# EAGLE design npk_schematic (EAGLE 9.6.2)
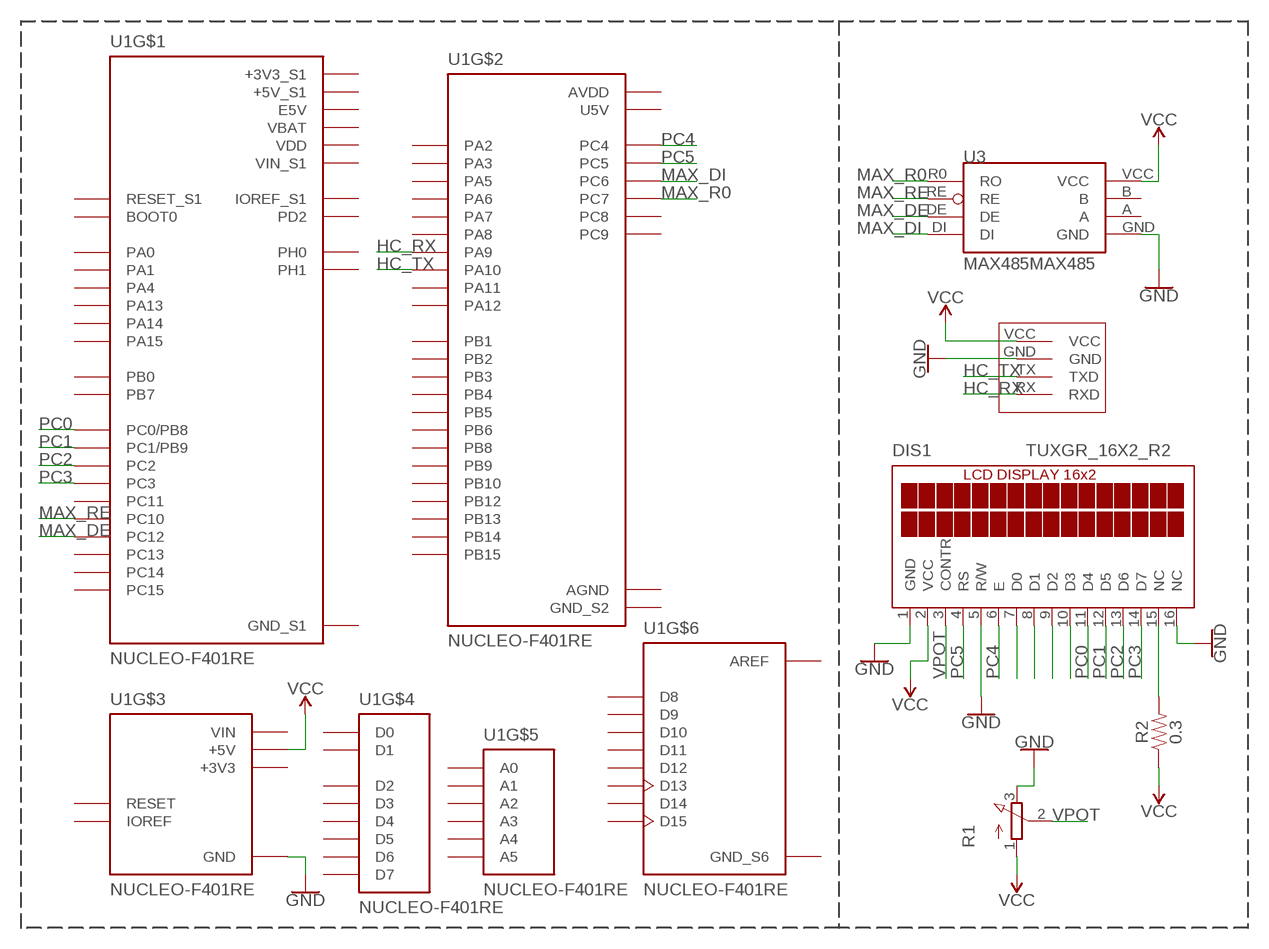
[diagram p0: schematic, sheet 1]

## Parts
DIS1  TUXGR_16X2_R2  [TUXGR_16X2_R2]
R1  3RP/1610N  [3RP/1610N]
R2  0.3  0.3OHM-0805-1/8W-1%  [0805]
U1  NUCLEO-F401RE  [ST_NUCLEO-F401RE]
U2  HC-06_ARDUıNO_BLUETOOTH  [HC-06_ARDUINO_BLUETOOTH]
U3  MAX485MAX485  [DIL08]

## Nets
GND: DIS1.1(GND) DIS1.5(R/W) DIS1.16(NC) R1.3(E) U1.GND@4(GND) U1.GND@6(GND) U2.GND U3.GND
HC_RX: U1.PA9@1(PA9) U2.RX(RXD)
HC_TX: U1.PA10@1(PA10) U2.TX(TXD)
MAX_DE: U1.PC12 U3.DE
MAX_DI: U1.PC6 U3.DI
MAX_R0: U1.PC7@1(PC7) U3.R0(RO)
MAX_RE: U1.PC10 U3.RE
N$1: DIS1.15(NC) R2.2
N$5: DIS1.7(D0)
N$6: DIS1.8(D1)
N$7: DIS1.9(D2)
N$8: DIS1.10(D3)
PC0: DIS1.11(D4) U1.PC0@1(PC0/PB8)
PC1: DIS1.12(D5) U1.PC1@1(PC1/PB9)
PC2: DIS1.13(D6) U1.PC2
PC3: DIS1.14(D7) U1.PC3
PC4: DIS1.6(E) U1.PC4
PC5: DIS1.4(RS) U1.PC5
VCC: DIS1.2(VCC) R1.1(A) R2.1 U1.+5V@2(+5V) U2.VCC U3.VCC
VPOT: DIS1.3(CONTR) R1.2(S)
Unconnected: U1.BOOTO(BOOT0) U1.IOREF@1(IOREF_S1) U1.IOREF@2(IOREF) U1.PA0@1(PA0) U1.PA0@2(A0) U1.PA1@1(PA1) U1.PA1@2(A1) U1.PA2@1(PA2) U1.PA2@2(D1) U1.PA3@1(PA3) U1.PA3@2(D0) U1.PA4@1(PA4) U1.PA4@2(A2) U1.PA5@1(PA5) U1.PA5@2(D13) U1.PA6@1(PA6) U1.PA6@2(D12) U1.PA7@1(PA7) U1.PA7@2(D11) U1.PA8@1(PA8) U1.PA8@2(D7) U1.PA9@2(D8) U1.PA10@2(D2) U1.PA11 U1.PA12 U1.PA13 U1.PA14 U1.PA15 U1.PB0@1(PB0) U1.PB0@2(A3) U1.PB1 U1.PB2 U1.PB3@1(PB3) U1.PB3@2(D3) U1.PB4@1(PB4) U1.PB4@2(D5) U1.PB5@1(PB5) U1.PB5@2(D4) U1.PB6@1(PB6) U1.PB6@2(D10) U1.PB7 U1.PB8@1(PB8) U1.PB8@2(D15) U1.PB9@1(PB9) U1.PB9@2(D14) U1.PB10@1(PB10) U1.PB10@2(D6) U1.PB12 U1.PB13 U1.PB14 U1.PB15 U1.PC0@2(A5) U1.PC1@2(A4) U1.PC7@2(D9) U1.PC8 U1.PC9 U1.PC11 U1.PC13 U1.PC14 U1.PC15 U1.PD2 U1.PH0 U1.PH1 U1.RESET@1(RESET_S1) U1.RESET@2(RESET) U3.A U3.B

## Power pins joined to a net without a drawn wire
+3V3: U1.+3V3@2(+3V3)
+3V3_S1: U1.+3V3@1(+3V3_S1)
+5V_S1: U1.+5V@1(+5V_S1)
AGND: U1.AGND
AREF: U1.AVDD@2(AREF)
AVDD: U1.AVDD@1(AVDD)
E5V: U1.E5V
GND_S1: U1.GND@1(GND_S1) U1.GND@2(GND_S1) U1.GND@3(GND_S1) U1.GND@5(GND_S1)
GND_S2: U1.GND@7(GND_S2) U1.GND@8(GND_S2)
GND_S6: U1.GND@9(GND_S6)
U5V: U1.U5V
VBAT: U1.VBAT
VDD: U1.VDD
VIN: U1.VIN@2(VIN)
VIN_S1: U1.VIN@1(VIN_S1)

## Library data of the parts
DIS1 = display-lcd:TUXGR_16X2_R2: Tuxgraphics LCD display 16x2 characters reflective, without background light Source: tuxgr_12x2_r2.pdf; OC_FARNELL: unknown; OC_NEWARK: unknown
R1 = pot:3RP/1610N: 16mm Potentiometer one level Source: http://www.alphapotentiometers.net/html/16mm_pot_2.html
R2 = SparkFun-Resistors:0.3OHM: 0.3Ω resistor A resistor is a passive two-terminal electrical component that implements electrical resistance as a circuit element. Resistors act to reduce current flow, and, at the same time, act to lower voltage levels within circuits. - Wikipedia; PROD_ID: RES-11622
U1 = NUCLEO-F401RE:NUCLEO-F401RE: STM32 Nucleo-64 development board with STM32F401RET6 MCU, supports Arduino and ST morpho connectivity Check prices <https://pricing.snapeda.com/parts/NUCLEO-F401RE/STMicroelectronics/view-part?ref=eda>; AVAILABILITY: In Stock; DESCRIPTION: STM32F401RE, mbed-Enabled Development Nucleo-64 STM32F4 ARM® Cortex®-M4 MCU 32-Bit Embedded Evaluation Board; MF: STMicroelectronics; MP: NUCLEO-F401RE; PACKAGE: None; PRICE: None; PURCHASE-URL: https://pricing.snapeda.com/search/part/NUCLEO-F401RE/?ref=eda
U2 = Eagle_Safa_Deneme1_Lib:HC-06_ARDUıNO_BLUETOOTH
U3 = MAX485:MAX485: Check prices <https://pricing.snapeda.com/parts/MAX485/Maxim%20Integrated/view-part?ref=eda>

## Board
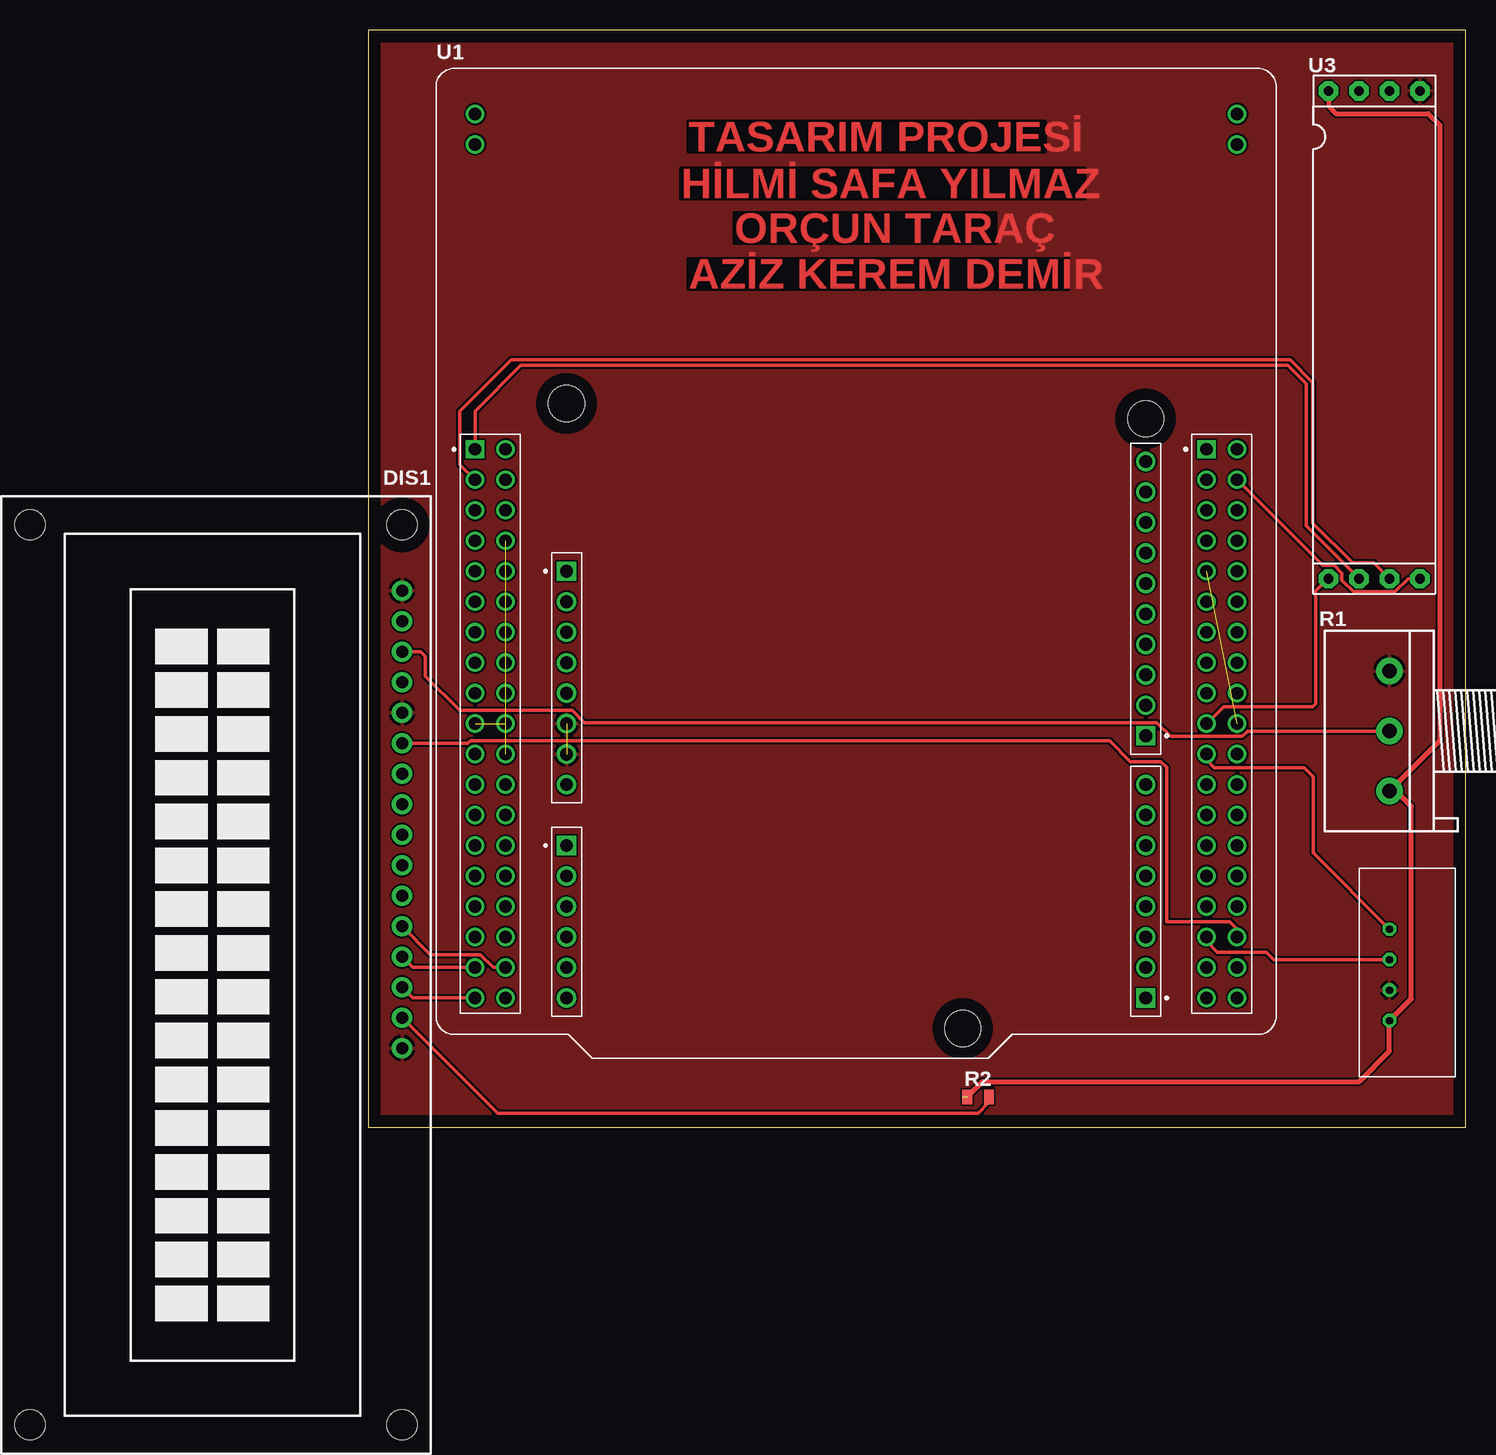
[diagram p1: board, top side]
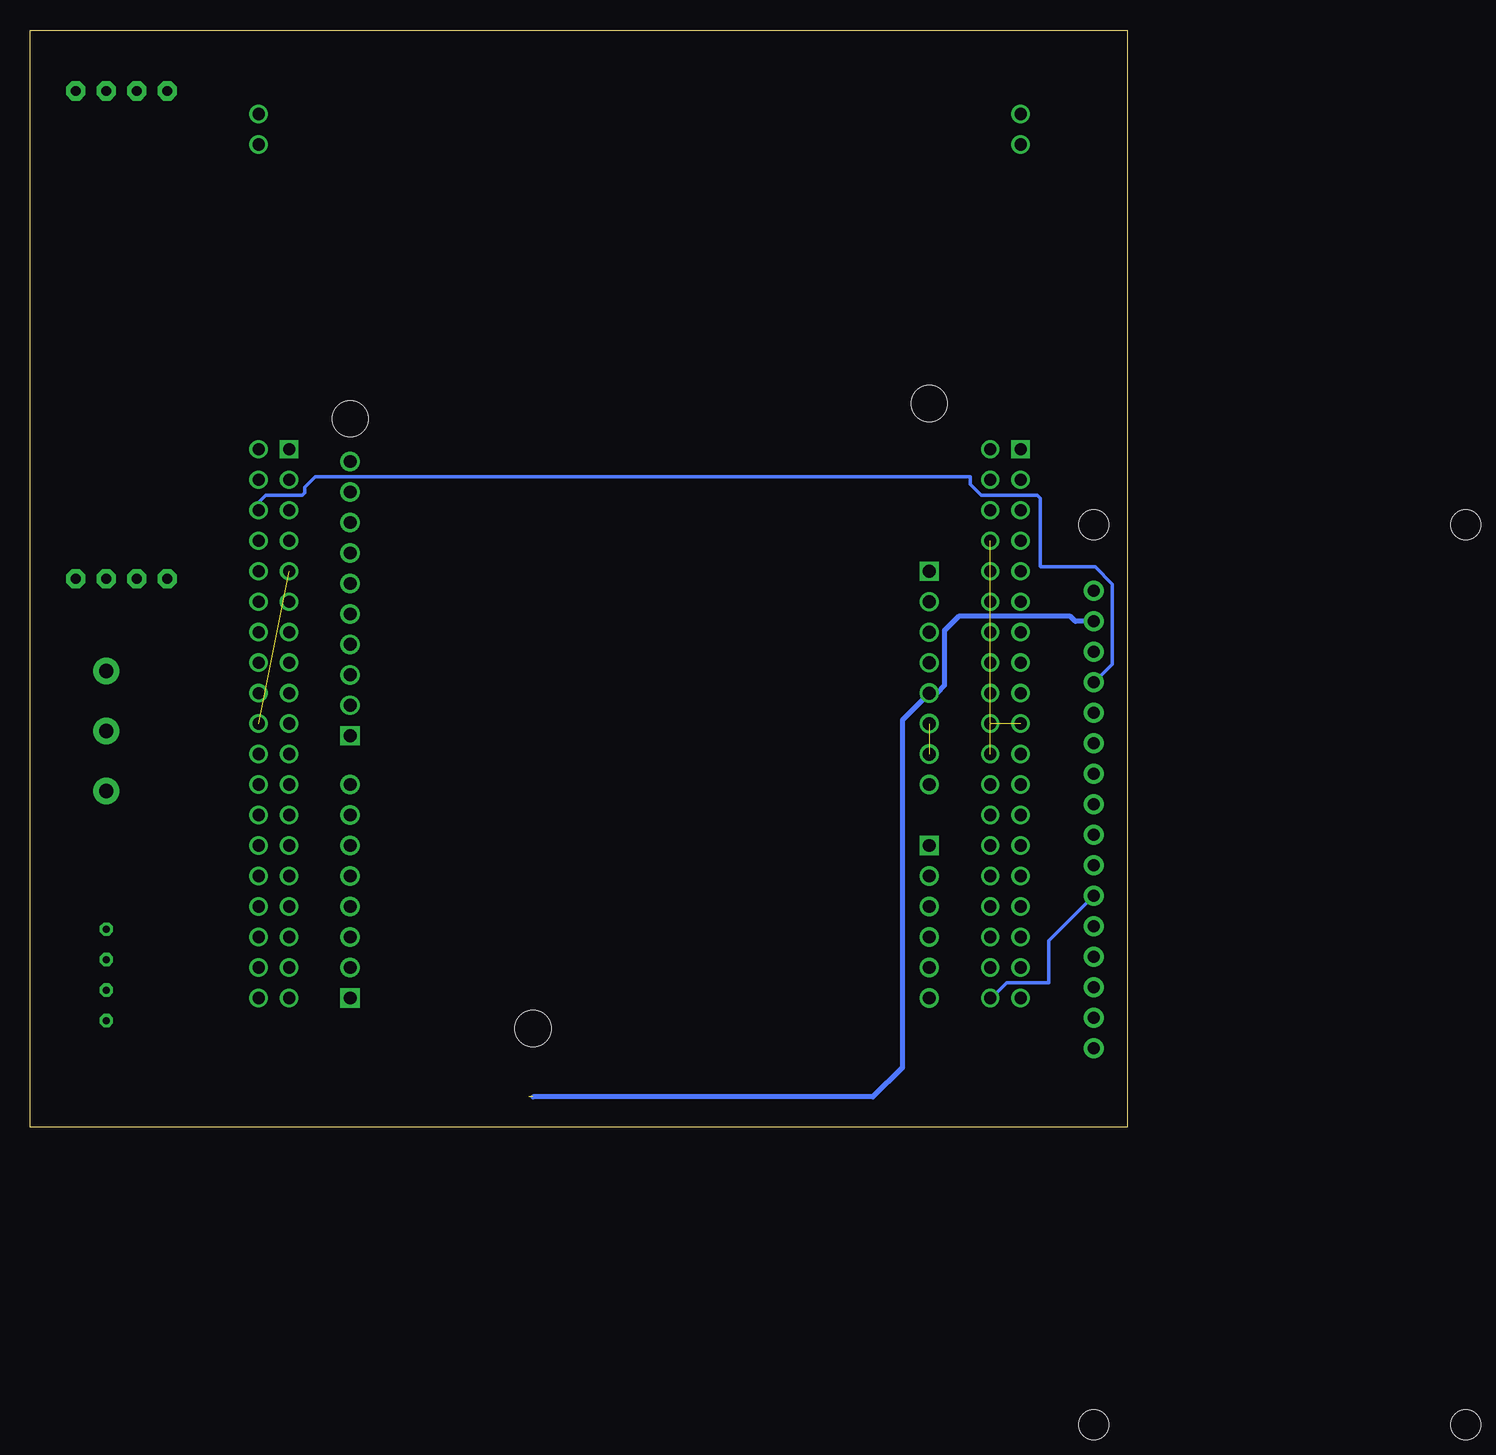
[diagram p2: board, bottom side, seen from below]

Size 91.45 x 91.44 mm. Coordinates in mm from the lower left corner, seen from the top.
Outline: 0,0 91.44,0 91.44,91.44 0,91.44 0,0
Copper layers (1*16): Top 0.035mm / dielectric 1.5mm / Bottom 0.035mm
Design rules "default": minimum track width 6mil, minimum drill 0.35mm, track to track 6mil, track to pad 6mil, pad to pad 6mil, via to via 6mil, smd to smd 6mil, copper to edge 40mil, drill to drill 6mil, minimum pad ring 10mil, minimum via ring 8mil, stop-mask expansion 4mil, vias tented up to drill 0mil, thermal gap 10mil

### Footprints (pad centres in the part's own frame; a part is rotated, then mirrored left to right if it is on the bottom)
TUXGR_16X2_R2 = drill 1 pad 1.676: 1 -32,15.5; 2 -29.46,15.5; 3 -26.92,15.5; 4 -24.38,15.5; 5 -21.84,15.5; 6 -19.3,15.5; 7 -16.76,15.5; 8 -14.22,15.5; 9 -11.68,15.5; 10 -9.14,15.5; 11 -6.6,15.5; 12 -4.06,15.5; 13 -1.52,15.5; 14 1.02,15.5; 15 3.56,15.5; 16 6.1,15.5 | hole 2.5: -37.5,-15.5; 37.5,-15.5; -37.5,15.5; 37.5,15.5
3RP/1610N = drill 1.2 pad 2.184: 1 -5,0; 2 0,0; 3 5,0
0805 = smd 0.8 x 1.2: 1 -0.9,0; 2 0.9,0
ST_NUCLEO-F401RE = drill 1.02: +3V3@1 -29.21,-8.27; +5V@1 -29.21,-10.81; AGND 31.75,-28.59; AVDD@1 29.21,1.89; BOOTO -31.75,1.89; CN7_39 -31.75,37.45; CN7_40 -31.75,34.91; CN10_39 31.75,37.45; CN10_40 31.75,34.91; E5V -29.21,4.43; GND@1 -29.21,1.89; GND@2 -31.75,-13.35; GND@3 -29.21,-15.89; GND@5 -29.21,-13.35; GND@7 29.21,-0.65; GND@8 31.75,-13.35; IOREF@1 -29.21,-3.19; NC@1 -31.75,-0.65; NC@2 -29.21,-0.65; NC@4 -31.75,-3.19; NC@5 -29.21,-20.97; NC@6 31.75,-0.65; NC@7 31.75,-10.81; NC@8 31.75,-33.67; NC@9 31.75,-36.21; PA0@1 -29.21,-23.51; PA1@1 -29.21,-26.05; PA2@1 29.21,-33.67; PA3@1 29.21,-36.21; PA4@1 -29.21,-28.59; PA5@1 29.21,-3.19; PA6@1 29.21,-5.73; PA7@1 29.21,-8.27; PA8@1 29.21,-18.43; PA9@1 29.21,-15.89; PA10@1 29.21,-31.13; PA11 31.75,-5.73; PA12 31.75,-3.19; PA13 -31.75,-5.73; PA14 -31.75,-8.27; PA15 -31.75,-10.81; PB0@1 -29.21,-31.13; PB1 31.75,-18.43; PB2 31.75,-15.89; PB3@1 29.21,-28.59; PB4@1 29.21,-23.51; PB5@1 29.21,-26.05; PB6@1 29.21,-10.81; PB7 -31.75,-15.89; PB8@1 29.21,6.97; PB9@1 29.21,4.43; PB10@1 29.21,-20.97; PB12 31.75,-8.27; PB13 31.75,-26.05; PB14 31.75,-23.51; PB15 31.75,-20.97; PC0@1 -29.21,-36.21; PC1@1 -29.21,-33.67; PC2 -31.75,-33.67; PC3 -31.75,-36.21; PC4 31.75,-31.13; PC5 31.75,4.43; PC6 31.75,6.97; PC7@1 29.21,-13.35; PC8 31.75,9.51; PC11 -29.21,9.51; PC12 -31.75,6.97; PC13 -31.75,-18.43; PC14 -31.75,-20.97; PC15 -31.75,-23.51; PD2 -29.21,6.97; PH0 -31.75,-26.05; PH1 -31.75,-28.59; RESET@1 -29.21,-5.73; U5V 31.75,1.89; VBAT -31.75,-31.13; VDD -31.75,4.43; VIN@1 -29.21,-18.43 | drill 1.07: +3V3@2 -24.13,-8.27; +5V@2 -24.13,-10.81; AVDD@2 24.13,3.41; GND@4 -24.13,-15.89; GND@6 -24.13,-13.35; GND@9 24.13,0.87; IOREF@2 -24.13,-3.19; PA1@2 -24.13,-26.05; PA2@2 24.13,-33.67; PA4@2 -24.13,-28.59; PA5@2 24.13,-1.67; PA6@2 24.13,-4.21; PA7@2 24.13,-6.75; PA8@2 24.13,-18.43; PA10@2 24.13,-31.13; PB0@2 -24.13,-31.13; PB3@2 24.13,-28.59; PB4@2 24.13,-23.51; PB5@2 24.13,-26.05; PB6@2 24.13,-9.29; PB8@2 24.13,8.49; PB9@2 24.13,5.95; PB10@2 24.13,-20.97; PC0@2 -24.13,-36.21; PC1@2 -24.13,-33.67; PC7@2 24.13,-11.83; RESET@2 -24.13,-5.73; VIN@2 -24.13,-18.43 | drill 1.07 square: NC@3 -24.13,-0.65; PA0@2 -24.13,-23.51; PA3@2 24.13,-36.21; PA9@2 24.13,-14.37 | drill 1.02 square: PC9 29.21,9.51; PC10 -31.75,9.51 | hole 3: 8.89,-38.75; 24.13,12.05; -24.13,13.32
HC-06_ARDUINO_BLUETOOTH = drill 0.6 octagon: GND 7.62,2.54; RX 2.54,2.54; TX 5.08,2.54; VCC 10.16,2.54
DIL08 = drill 0.813 pad 1.6 octagon: A 1.27,3.81; B -1.27,3.81; DE 1.27,-36.83; DI 3.81,-36.83; GND 3.81,3.81; R0 -3.81,-36.83; RE -1.27,-36.83; VCC -3.81,3.81

### Placement (x,y rotation side)
DIS1  -12.7,12.7 270 top
R1  85.09,33.02 90 top
R2  50.8,2.54 0 top
U1  40.64,46.99 0 top
U2  82.55,19.05 270 top
U3  83.82,82.55 0 top

### Tracks (layer width: path | path; a pad name or v marks a point on that pad's centre or on a via)
GND  (1 unrouted)
  pour Top: -2.54,96.52 -2.54,-5.08 96.52,-5.08 96.52,96.52
GND_S1  (3 unrouted)
GND_S2  (1 unrouted)
HC_RX
  Top 0.305: U2.RX 78.74,22.86 78.74,29.21 77.98,29.97 70.5,29.97 69.85,30.62 U1.PA9@1
HC_TX
  Top 0.305: U2.TX 75.46,13.97 74.83,14.6 70.74,14.6 69.85,15.49 U1.PA10@1
MAX_DE
  Top 0.305: U3.DE 83.78,47.03 82.04,47.03 78.72,50.36 78.72,62.05 76.81,63.96 11.89,63.96 7.62,59.69 7.62,55.23 U1.PC12
MAX_DI
  Top 0.305: U3.DI 86.65,45.72 85.55,44.62 82.09,44.62 81.11,45.59 81.11,46.18 80.47,46.83 79.53,46.83 U1.PC6
MAX_R0
  Top 0.305: U1.PC7@1 71.28,35.07 78.72,35.07 78.93,35.28 78.93,44.73 79.92,45.72 U3.R0
MAX_RE
  Top 0.305: U3.RE 78.14,50.13 78.14,61.98 76.62,63.5 12.7,63.5 8.89,59.69 U1.PC10
N$1
  Top 0.305: DIS1.15 10.77,1.17 50.8,1.17 51.7,2.07 R2.2
PC0
  Bottom 0.305: U1.PC0@1 11.32,10.78 10.05,12.05 6.55,12.05 6.55,15.55 DIS1.11
PC1
  Top 0.305: U1.PC1@1 10.4,13.32 9.33,14.39 5.17,14.39 DIS1.12
PC2
  Top 0.305: DIS1.13 3.7,13.32 U1.PC2
PC3
  Top 0.305: DIS1.14 3.7,10.78 U1.PC3
PC4
  Top 0.305: DIS1.6 8.28,32 8.48,32.21 61.77,32.21 63.5,30.48 66.04,30.48 66.51,30.01 66.51,17.12 71.78,17.12 72.39,16.51 U1.PC4
PC5
  Bottom 0.305: DIS1.4 2.76,37.08 1.25,38.59 1.25,45.26 2.69,46.7 7.21,46.7 7.25,46.74 7.25,52.41 7.52,52.68 12.19,52.68 13.08,53.57 13.08,54.22 67.66,54.22 68.56,53.33 68.56,52.87 68.77,52.65 71.81,52.65 72.39,52.07 U1.PC5
VCC  (1 unrouted)
  Top 0.406: R2.1 51.17,3.81 82.55,3.81 85.09,6.35 U2.VCC 86.91,10.71 86.91,26.77 85.66,28.02 R1.1 89.28,32.21 89.28,83.53 88.34,84.47 80.63,84.47 80.01,85.09 U3.VCC
  Bottom 0.406: DIS1.2 4.33,42.16 4.75,42.58 14.05,42.58 15.24,41.39 15.24,36.83 15.89,36.18 U1.+5V@2 18.76,33.93 18.76,4.98 21.21,2.53 49.52,2.53 49.53,2.54
VPOT
  Top 0.305: R1.2 73.28,33.02 72.83,32.57 66.86,32.57 65.7,33.73 17.99,33.73 16.97,34.75 7.59,34.75 4.74,37.61 4.74,37.68 4.74,37.94 4.74,39.24 4.36,39.62 DIS1.3

### Text on the board
Top: TASARIM PROJESİ | HİLMİ SAFA YILMAZ | ORÇUN TARAÇ | AZİZ KEREM DEMİR
tStop: TASARIM PROJESİ | HİLMİ SAFA YILMAZ | ORÇUN TARAÇ | AZİZ KEREM DEMİR